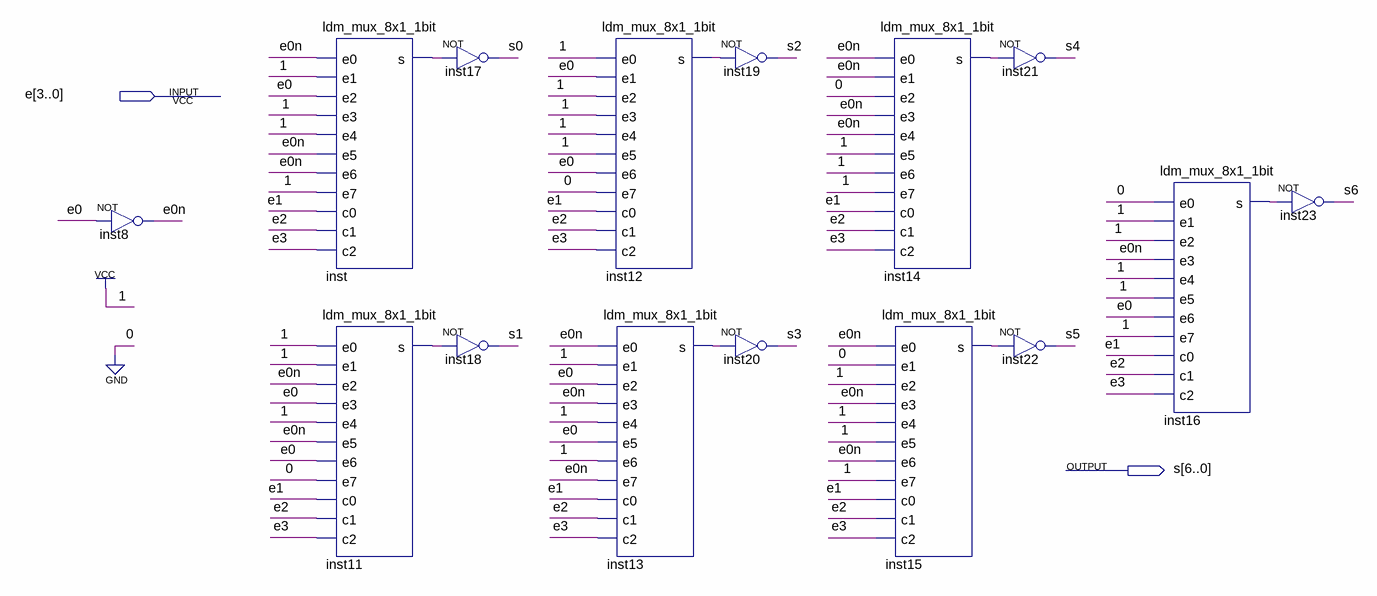
[diagram p0: schematic sheet]
// Quartus schematic ldm_disp_7seg.bdf as structural Verilog: 15 symbols, 2 pins
module ldm_disp_7seg (
  input  [3:0] e,
  output [6:0] s
);

  wire e0n, inst11_s, inst12_s, inst13_s, inst14_s, inst15_s, inst16_s, inst_s;

  not inst8 (e0n, e[0]);
  ldm_mux_8x1_1bit inst (
    .e0(e0n), .e1(1'b1), .e2(e[0]), .e3(1'b1), .e4(1'b1), .e5(e0n), .e6(e0n), .e7(1'b1), .c0(e[1]),
    .c1(e[2]), .c2(e[3]), .s(inst_s));
  ldm_mux_8x1_1bit inst11 (
    .e0(1'b1), .e1(1'b1), .e2(e0n), .e3(e[0]), .e4(1'b1), .e5(e0n), .e6(e[0]), .e7(1'b0), .c0(e[1]),
    .c1(e[2]), .c2(e[3]), .s(inst11_s));
  not inst17 (s[0], inst_s);
  not inst18 (s[1], inst11_s);
  ldm_mux_8x1_1bit inst12 (
    .e0(1'b1), .e1(e[0]), .e2(1'b1), .e3(1'b1), .e4(1'b1), .e5(1'b1), .e6(e[0]), .e7(1'b0), .c0(e[1]),
    .c1(e[2]), .c2(e[3]), .s(inst12_s));
  ldm_mux_8x1_1bit inst13 (
    .e0(e0n), .e1(1'b1), .e2(e[0]), .e3(e0n), .e4(1'b1), .e5(e[0]), .e6(1'b1), .e7(e0n), .c0(e[1]),
    .c1(e[2]), .c2(e[3]), .s(inst13_s));
  not inst19 (s[2], inst12_s);
  not inst20 (s[3], inst13_s);
  ldm_mux_8x1_1bit inst14 (
    .e0(e0n), .e1(e0n), .e2(1'b0), .e3(e0n), .e4(e0n), .e5(1'b1), .e6(1'b1), .e7(1'b1), .c0(e[1]), .c1(e[2]),
    .c2(e[3]), .s(inst14_s));
  ldm_mux_8x1_1bit inst15 (
    .e0(e0n), .e1(1'b0), .e2(1'b1), .e3(e0n), .e4(1'b1), .e5(1'b1), .e6(e0n), .e7(1'b1), .c0(e[1]),
    .c1(e[2]), .c2(e[3]), .s(inst15_s));
  not inst21 (s[4], inst14_s);
  not inst22 (s[5], inst15_s);
  ldm_mux_8x1_1bit inst16 (
    .e0(1'b0), .e1(1'b1), .e2(1'b1), .e3(e0n), .e4(1'b1), .e5(1'b1), .e6(e[0]), .e7(1'b1), .c0(e[1]),
    .c1(e[2]), .c2(e[3]), .s(inst16_s));
  not inst23 (s[6], inst16_s);
endmodule
